# EAGLE design Proto_shield_REV3 (EAGLE 6.6.0)
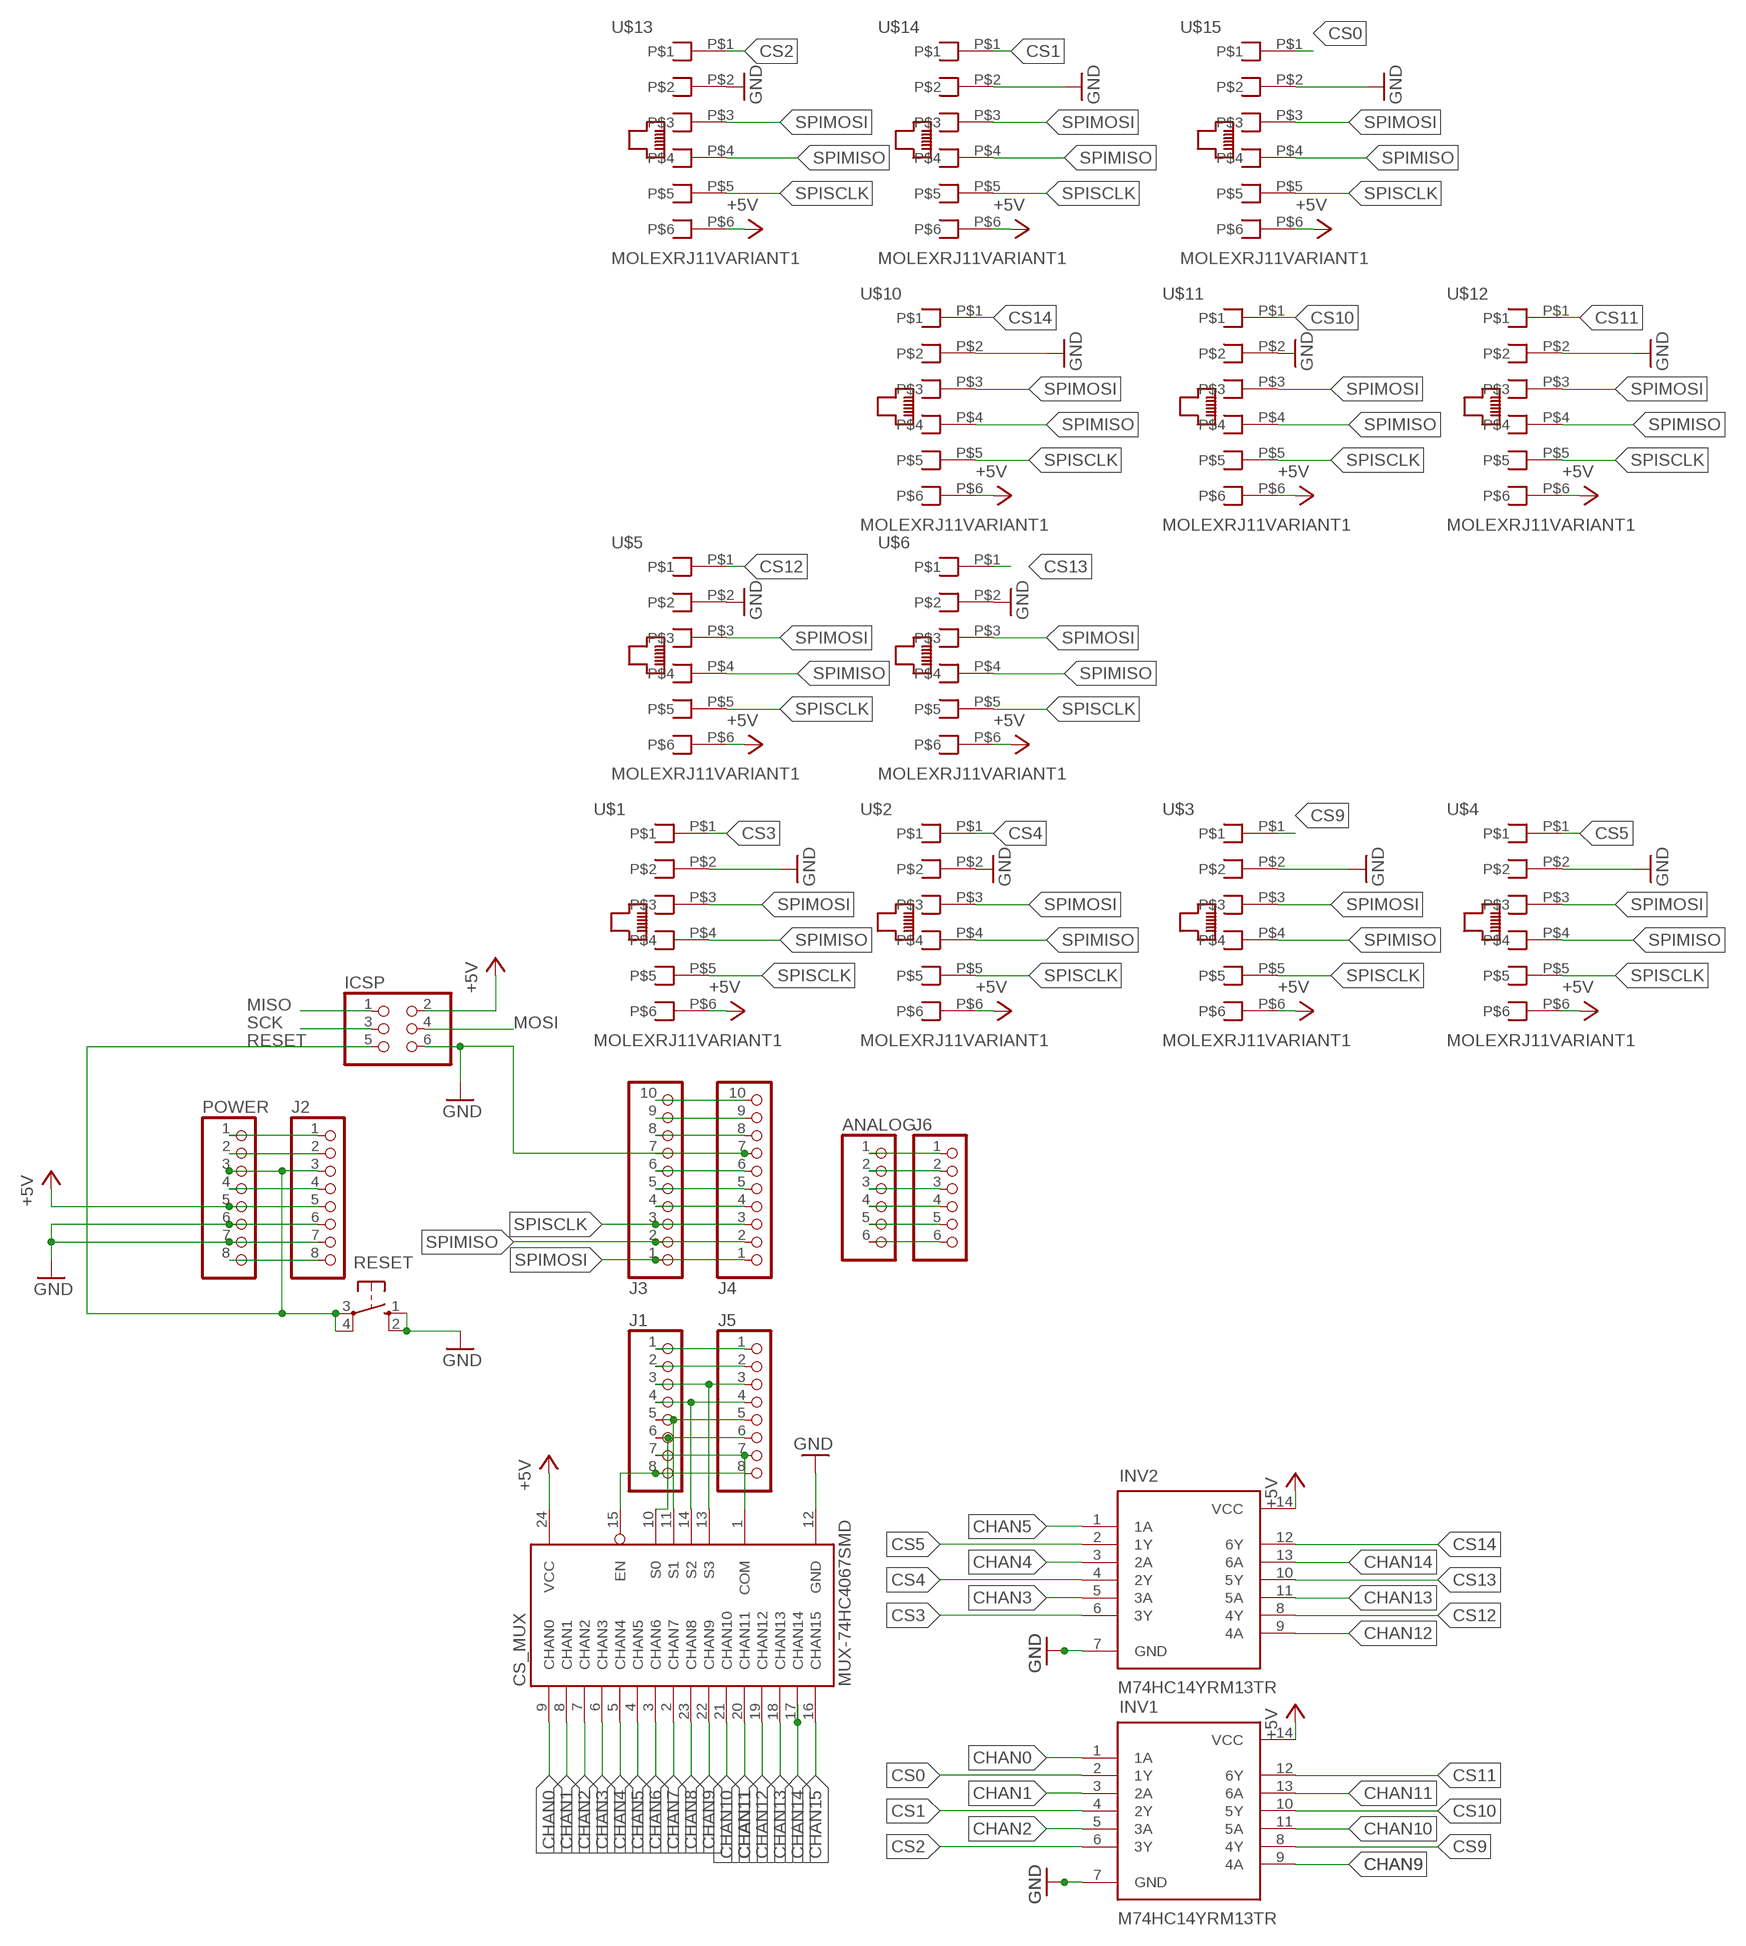
[diagram p0: schematic, sheet 1]

## Parts
ANALOG  PINHD-1X6  [1X06]
CS_MUX  MUX-74HC4067SMD  [SSOP24]
ICSP  PINHD-2X3  [2X03]
INV1  M74HC14YRM13TR  [SO14]
INV2  M74HC14YRM13TR  [SO14]
J1  PINHD-1X8TH  [1X08-TH]
J2  PINHD-1X8TH  [1X08-TH]
J3  PINHD-1X10TH  [1X10-TH]
J4  PINHD-1X10TH  [1X10-TH]
J5  PINHD-1X8TH  [1X08-TH]
J6  PINHD-1X6  [1X06]
POWER  PINHD-1X8TH  [1X08-TH]
RESET  10-XX  [B3F-10XX]
U$1  MOLEXRJ11VARIANT1  [RJ11MOLEX]
U$2  MOLEXRJ11VARIANT1  [RJ11MOLEX]
U$3  MOLEXRJ11VARIANT1  [RJ11MOLEX]
U$4  MOLEXRJ11VARIANT1  [RJ11MOLEX]
U$5  MOLEXRJ11VARIANT1  [RJ11MOLEX]
U$6  MOLEXRJ11VARIANT1  [RJ11MOLEX]
U$10  MOLEXRJ11VARIANT1  [RJ11MOLEX]
U$11  MOLEXRJ11VARIANT1  [RJ11MOLEX]
U$12  MOLEXRJ11VARIANT1  [RJ11MOLEX]
U$13  MOLEXRJ11VARIANT1  [RJ11MOLEX]
U$14  MOLEXRJ11VARIANT1  [RJ11MOLEX]
U$15  MOLEXRJ11VARIANT1  [RJ11MOLEX]

## Nets
+5V [+5V]: CS_MUX.24(VCC) ICSP.2 INV1.14(VCC) INV2.14(VCC) J2.5 POWER.5 U$1.P$6 U$2.P$6 U$3.P$6 U$4.P$6 U$5.P$6 U$6.P$6 U$10.P$6 U$11.P$6 U$12.P$6 U$13.P$6 U$14.P$6 U$15.P$6
+9V: J2.8 POWER.8
CHAN0: CS_MUX.9(CHAN0) INV1.1(1A)
CHAN1: CS_MUX.8(CHAN1) INV1.3(2A)
CHAN2: CS_MUX.7(CHAN2) INV1.5(3A)
CHAN3: CS_MUX.6(CHAN3) INV2.5(3A)
CHAN4: CS_MUX.5(CHAN4) INV2.3(2A)
CHAN5: CS_MUX.4(CHAN5) INV2.1(1A)
CHAN6: CS_MUX.3(CHAN6)
CHAN7: CS_MUX.2(CHAN7)
CHAN8: CS_MUX.23(CHAN8)
CHAN9: CS_MUX.22(CHAN9) INV1.9(4A)
CHAN10: CS_MUX.21(CHAN10) INV1.11(5A)
CHAN11: CS_MUX.20(CHAN11) INV1.13(6A)
CHAN12: CS_MUX.19(CHAN12) INV2.9(4A)
CHAN13: CS_MUX.18(CHAN13) INV2.11(5A)
CHAN14: CS_MUX.17(CHAN14) INV2.13(6A)
CHAN15: CS_MUX.16(CHAN15)
CS0: INV1.2(1Y) U$15.P$1
CS1: INV1.4(2Y) U$14.P$1
CS2: INV1.6(3Y) U$13.P$1
CS3: INV2.6(3Y) U$1.P$1
CS4: INV2.4(2Y) U$2.P$1
CS5: INV2.2(1Y) U$4.P$1
CS9: INV1.8(4Y) U$3.P$1
CS10: INV1.10(5Y) U$11.P$1
CS11: INV1.12(6Y) U$12.P$1
CS12: INV2.8(4Y) U$5.P$1
CS13: INV2.10(5Y) U$6.P$1
CS14: INV2.12(6Y) U$10.P$1
GND [GND]: CS_MUX.12(GND) ICSP.6 INV1.7(GND) INV2.7(GND) J2.7 J3.7 J4.7 POWER.7 RESET.1(S) RESET.2(S1) U$1.P$2 U$2.P$2 U$3.P$2 U$4.P$2 U$5.P$2 U$6.P$2 U$10.P$2 U$11.P$2 U$12.P$2 U$13.P$2 U$14.P$2 U$15.P$2
MISO: ICSP.1
MOSI: ICSP.4
N$1: J3.6 J4.6
N$3: J3.4 J4.4
N$4: J3.5 J4.5
N$8: J1.1 J5.1
N$9: J1.2 J5.2
N$10: CS_MUX.13(S3) J1.3 J5.3
N$11: CS_MUX.14(S2) J1.4 J5.4
N$12: CS_MUX.11(S1) J1.5 J5.5
N$13: CS_MUX.10(S0) J1.6 J5.6
N$14: CS_MUX.1(COM) J1.7 J5.7
N$15: CS_MUX.15(EN) J1.8 J5.8
N$18: ANALOG.1 J6.1
N$19: ANALOG.2 J6.2
N$20: ANALOG.3 J6.3
N$21: ANALOG.4 J6.4
N$22: ANALOG.5 J6.5
N$23: ANALOG.6 J6.6
N$25: J2.6 POWER.6
N$31: J2.2 POWER.2
N$32: J2.1 POWER.1
N$141: J3.9 J4.9
N$142: J3.10 J4.10
N$222: J3.8 J4.8
N$223: J2.4 POWER.4
RESET: ICSP.5 J2.3 POWER.3 RESET.3(P) RESET.4(P1)
SCK: ICSP.3
SPIMISO: J3.2 J4.2 U$1.P$4 U$2.P$4 U$3.P$4 U$4.P$4 U$5.P$4 U$6.P$4 U$10.P$4 U$11.P$4 U$12.P$4 U$13.P$4 U$14.P$4 U$15.P$4
SPIMOSI: J3.1 J4.1 U$1.P$3 U$2.P$3 U$3.P$3 U$4.P$3 U$5.P$3 U$6.P$3 U$10.P$3 U$11.P$3 U$12.P$3 U$13.P$3 U$14.P$3 U$15.P$3
SPISCLK: J3.3 J4.3 U$1.P$5 U$2.P$5 U$3.P$5 U$4.P$5 U$5.P$5 U$6.P$5 U$10.P$5 U$11.P$5 U$12.P$5 U$13.P$5 U$14.P$5 U$15.P$5

## Library data of the parts
ANALOG J6 = pinhead:PINHD-1X6: PIN HEADER
CS_MUX = Analog-Digital-Mux-Breakout:MUX-74HC4067
ICSP = SmartPrj:PINHD-2X3: PIN HEADER
INV1 INV2 = evan1:M74HC14YRM13TR: INV inverter inversion not gate 6 line
J1 J2 J5 POWER = SmartPrj:PINHD-1X8: PIN HEADER
J3 J4 = SmartPrj:PINHD-1X10: PIN HEADER
RESET = switch-omron:10-XX: OMRON SWITCH
U$1-U$6 U$10-U$15 = evan1:MOLEXRJ11: MOLEX RJ11 TELEPHONE CONNECTOR 6 WIRE SMD

## Net classes
1 +5V: width 0.457 mm
2 GND: width 0.457 mm

## Board
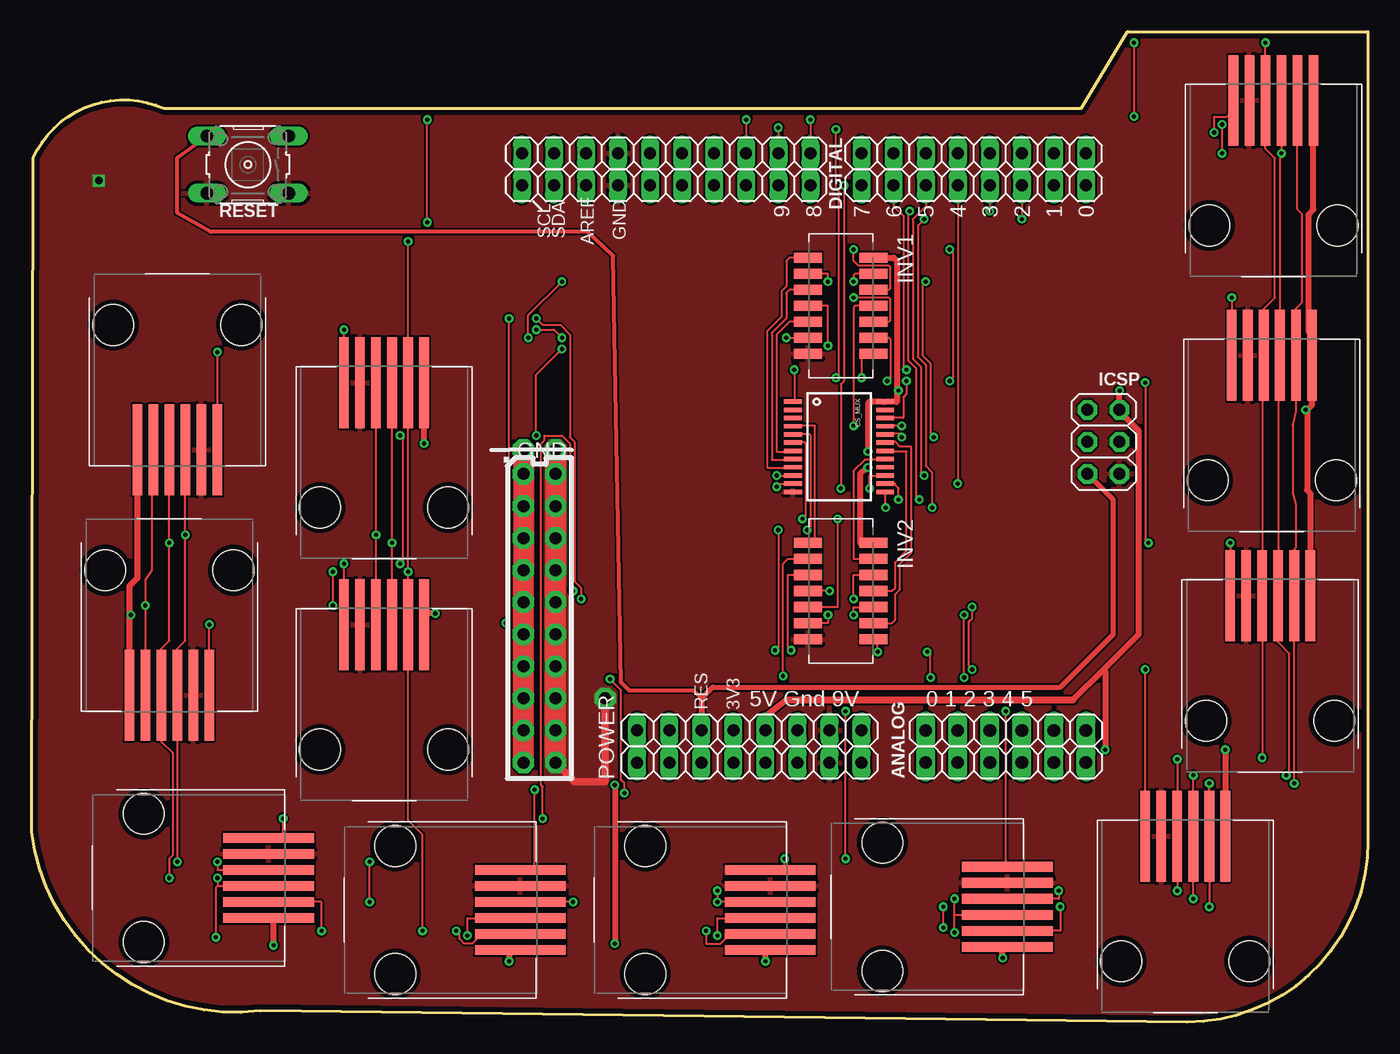
[diagram p1: board, top side]
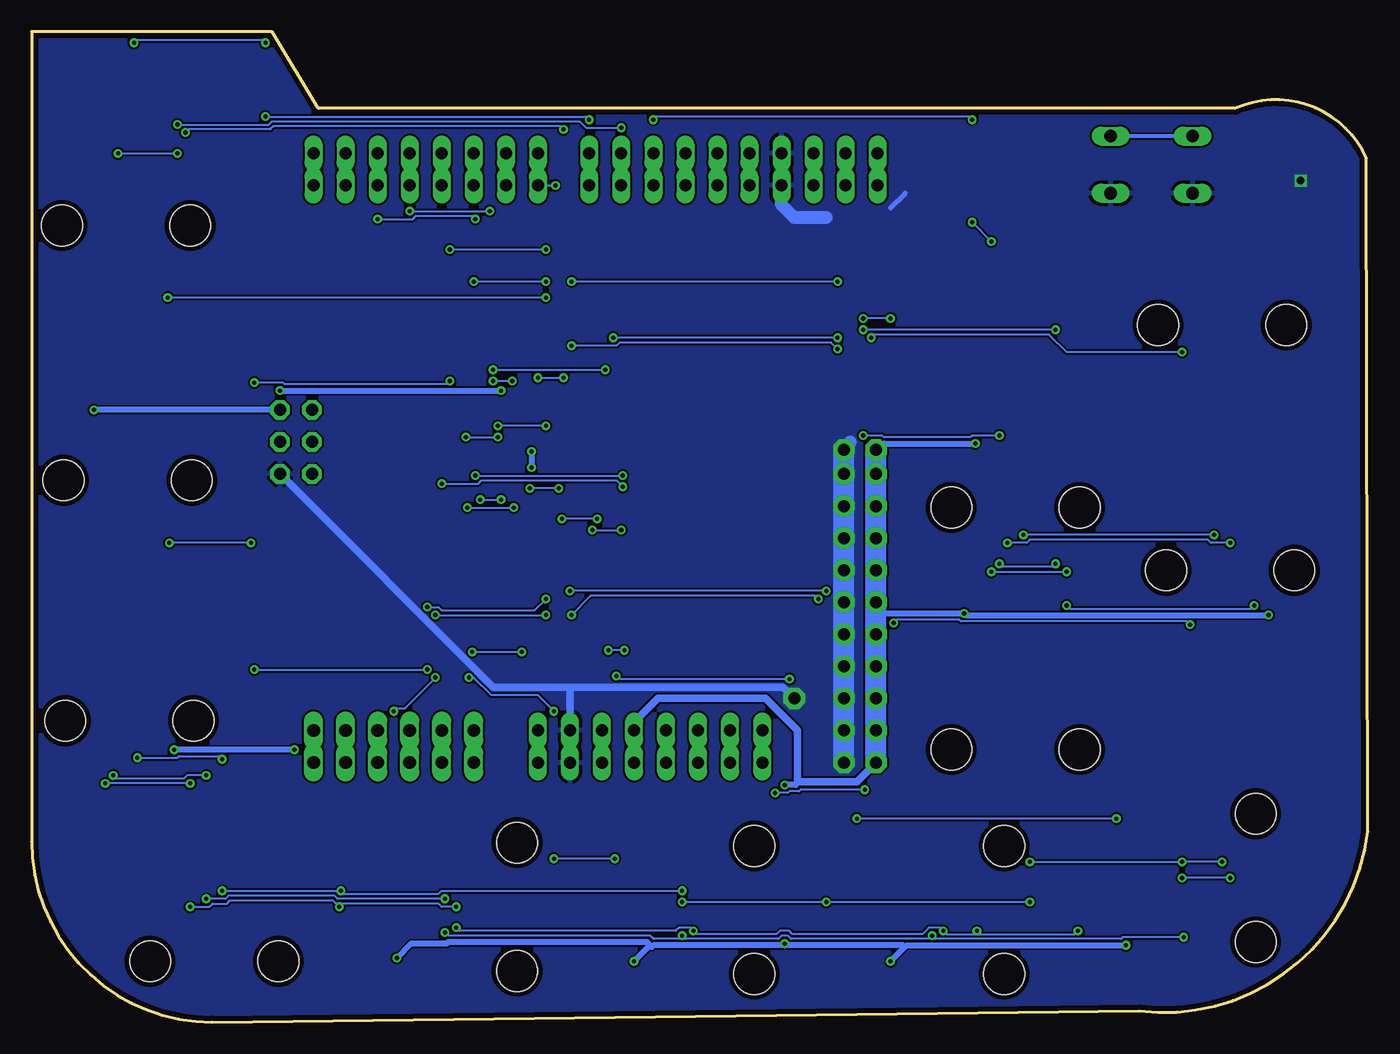
[diagram p2: board, bottom side, seen from below]

Size 105.92 x 78.49 mm. Coordinates in mm from the lower left corner, seen from the top.
Outline: 83.19,72.39 86.87,78.49 105.92,78.49 105.92,14.34 arc-90 91.58,0 18.14,0.89 arc-90 0,15.1 0.13,68.47 arc-90 10.52,72.39 83.19,72.39
Copper layers (1*16): Top 0.0356mm / dielectric 1.5011mm / Bottom 0.0356mm
Design rules "OSHParkPCBOrder": minimum track width 6mil, minimum drill 13mil, track to track 6mil, track to pad 6mil, pad to pad 6mil, via to via 6mil, smd to smd 6mil, copper to edge 15mil, drill to drill 6mil, minimum pad ring 7mil, minimum via ring 7mil, stop-mask expansion 3mil, vias tented up to drill 0mil, thermal gap 10mil

### Footprints (pad centres in the part's own frame; a part is rotated, then mirrored left to right if it is on the bottom)
1X06 = drill 1.016 long: 1 -6.35,0; 2 -3.81,0; 3 -1.27,0; 4 1.27,0; 5 3.81,0; 6 6.35,0
SSOP24 = smd 0.348 x 1.397: 1 -3.575,-3.656; 2 -2.925,-3.656; 3 -2.275,-3.656; 4 -1.625,-3.656; 5 -0.975,-3.656; 6 -0.325,-3.656; 7 0.325,-3.656; 8 0.975,-3.656; 9 1.625,-3.656; 10 2.275,-3.656; 11 2.925,-3.656; 12 3.575,-3.656; 13 3.575,3.656; 14 2.925,3.656; 15 2.275,3.656; 16 1.625,3.656; 17 0.975,3.656; 18 0.325,3.656; 19 -0.325,3.656; 20 -0.975,3.656; 21 -1.625,3.656; 22 -2.275,3.656; 23 -2.925,3.656; 24 -3.575,3.656
2X03 = drill 0.95 pad 1.55 octagon: 1 -2.54,-1.27; 2 -2.54,1.27; 3 0,-1.27; 4 0,1.27; 5 2.54,-1.27; 6 2.54,1.27
SO14 = smd 0.8 x 2.2: 1 -3.81,-2.6; 2 -2.54,-2.6; 3 -1.27,-2.6; 4 0,-2.6; 5 1.27,-2.6; 6 2.54,-2.6; 7 3.81,-2.6; 8 3.81,2.6; 9 2.54,2.6; 10 1.27,2.6; 11 0,2.6; 12 -1.27,2.6; 13 -2.54,2.6; 14 -3.81,2.6
1X08-TH = drill 0.95 pad 1.422 long: 1 -8.89,0; 2 -6.35,0; 3 -3.81,0; 4 -1.27,0; 5 1.27,0; 6 3.81,0; 7 6.35,0; 8 8.89,0
1X10-TH = drill 0.95 pad 1.422 long: 1 -11.43,0; 2 -8.89,0; 3 -6.35,0; 4 -3.81,0; 5 -1.27,0; 6 1.27,0; 7 3.81,0; 8 6.35,0; 9 8.89,0; 10 11.43,0
B3F-10XX = drill 1.016 long: 1 -3.251,2.261; 2 3.251,2.261; 3 -3.251,-2.261; 4 3.251,-2.261
RJ11MOLEX = smd 0.76 x 7.2: P$1 -3.175,0; P$2 -1.905,0; P$3 -0.635,0; P$4 0.635,0; P$5 1.905,0; P$6 3.175,0 | hole 3.25: -5.08,-9.9; 5.08,-9.9

### Placement (x,y rotation side)
ANALOG  77.22,20.57 0 top
CS_MUX  64.01,45.59 270 top
ICSP  84.96,45.97 270 top
INV1  64.13,56.77 270 top
INV2  64.13,34.16 270 top
J1  74.68,68.83 180 top
J2  56.9,20.57 0 top
J3  50.29,68.83 180 top
J4  50.29,66.29 180 top
J5  74.68,66.29 180 top
J6  77.22,23.11 0 top
POWER  56.9,23.11 0 top
RESET  17.14,67.94 180 top
U$1  10.92,25.91 180 top
U$2  18.8,11.43 270 top
U$3  98.42,73.03 0 top
U$4  38.73,8.89 270 top
U$5  58.55,8.89 270 top
U$6  77.34,9.14 270 top
U$10  91.44,14.73 0 top
U$11  98.3,52.83 0 top
U$12  98.17,33.78 0 top
U$13  27.94,50.67 0 top
U$14  27.94,31.5 0 top
U$15  11.56,45.34 180 top

### Tracks (layer width: path | path; a pad name or v marks a point on that pad's centre or on a via)
+5V  (via drill 0.33, 0.95 pad 1.7)
  Top 0.254: 60.71,25.65 60.71,25.53
  Top 0.406: 59.94,25.53 59.82,25.53
  Top 0.457: 82.55,25.53 84.96,27.94 | 84.96,27.94 87.76,30.73 87.76,46.86 86.23,48.39 | POWER.5 58.17,24.26 59.82,25.53 | U$2.P$6 19.18,8.26 v19.18,6.1 | v37.85,4.83 37.85,5.59 37.97,5.71 U$4.P$6 | U$5.P$6 58.17,5.71 v58.17,4.83 | U$6.P$6 76.96,5.97 v76.96,5.08 | U$12.P$6 101.35,41.91 101.09,42.16 101.09,48.51 | 101.09,48.51 101.47,48.9 U$11.P$6 101.47,54.48 101.22,54.74 101.22,64.01 101.6,64.39 U$3.P$6 | 7.75,32.26 7.75,34.54 8.38,35.18 U$15.P$6 | 7.75,32.26 U$1.P$6 | 68.58,50.04 68.58,60.33 68.33,60.58 INV1.14 | 68.58,50.04 68.58,49.15 67.69,49.15 CS_MUX.24 67.44,49.15 66.42,49.15 66.29,49.02 v66.29,45.21 | INV2.14 65.66,37.97 65.66,43.43 66.17,43.94 v66.29,43.94 | U$14.P$6 31.12,32.26 31.24,32.39 v32,32.39 | v31.12,45.85 U$13.P$6 | v94.61,21.59 U$10.P$6 | v85.09,21.59 85.09,27.81 84.96,27.94 | ICSP.2 v86.23,50.04 | v68.71,50.04 68.58,50.04 | v7.87,32.26 7.75,32.26 | v100.97,48.51 101.09,48.51 | v46.23,18.8 v46.23,6.22
  Top 0.559: 59.94,25.53 60.71,25.53 82.55,25.53 | 86.23,48.39 ICSP.2
  Top 1.676: v38.99,20.57 v38.99,23.11 v38.99,25.65 v38.99,28.19 v38.99,30.73 v38.99,33.27 v38.99,35.81 v38.99,38.35 v38.99,40.89 v38.99,43.43 v38.99,45.34
  Bottom 0.457: v19.18,6.1 36.58,6.1 36.7,5.97 | v37.85,4.83 36.7,5.97 | 57.02,5.97 v58.17,4.83 | 57.02,5.97 56.77,5.97 56.64,6.1 46.23,6.1 | 46.23,6.1 36.83,6.1 36.7,5.97 | v76.96,5.08 75.82,6.22 73.03,6.22 72.9,6.35 57.15,6.35 56.9,6.1 57.02,5.97 | v66.29,45.21 v66.29,43.94 | 38.99,32.39 v32,32.39 31.88,32.26 v7.87,32.26 | v31.12,45.85 38.35,45.85 v38.99,45.34 | v85.09,21.59 v94.61,21.59 | v86.23,50.04 v68.71,50.04 | ICSP.2 v100.97,48.51 | v46.23,18.8 45.34,18.8 45.21,19.05 | v46.23,6.22 46.23,6.1
  Bottom 0.61: v38.99,20.57 40.51,19.05 45.21,19.05 45.21,23.11 47.75,25.65 56.26,25.65 58.17,23.75 POWER.5 J2.5
  Bottom 1.676: v38.99,20.57 38.99,32.39 v38.99,45.34
+9V
  Bottom 0.61: J2.8 POWER.8
CHAN0
  Top 0.152: INV1.1 60.07,60.58 59.82,60.33 59.82,58.29 59.44,57.91 59.44,55.88 58.29,54.74 58.29,43.94 60.33,43.94 CS_MUX.9
CHAN1
  Top 0.152: INV1.3 60.07,58.04 59.82,57.79 59.82,55.75 58.67,54.61 58.67,44.58 60.33,44.58 CS_MUX.8
CHAN2
  Top 0.152: INV1.5 60.07,55.5 59.05,54.48 59.05,45.21 60.33,45.21 CS_MUX.7
CHAN3  (via drill 0.33)
  Top 0.152: INV2.5 63.88,32.89 v63.88,39.88 | v61.09,39.88 61.34,40.13 61.34,45.85 61.21,45.97 60.45,45.97 CS_MUX.6
  Bottom 0.152: v61.09,39.88 v63.88,39.88
CHAN4  (via drill 0.33)
  Top 0.152: INV2.3 59.94,35.43 59.94,29.59 60.07,29.46 v60.2,29.46 | v58.93,29.46 59.18,29.72 v59.18,38.99 | v61.47,38.99 61.72,39.24 61.72,46.48 61.59,46.61 60.45,46.61 CS_MUX.5
  Bottom 0.152: v58.93,29.46 v60.2,29.46 | v61.47,38.99 v59.18,38.99
CHAN5
  Top 0.152: INV2.1 62.1,37.97 62.1,47.24 60.45,47.24 CS_MUX.4
CHAN9  (via drill 0.33)
  Top 0.152: v69.34,50.8 69.34,49.78 69.09,49.53 69.09,47.88 67.69,47.88 CS_MUX.22 | v67.82,50.8 68.07,51.05 68.07,54.1 67.95,54.23 INV1.9
  Bottom 0.152: v67.82,50.8 v69.34,50.8
CHAN10  (via drill 0.33)
  Top 0.152: v68.96,47.24 67.69,47.24 CS_MUX.21 | v65.15,47.24 65.15,56.64 65.28,56.77 INV1.11
  Bottom 0.152: v65.15,47.24 v68.96,47.24
CHAN11  (via drill 0.33)
  Top 0.152: v68.96,46.35 68.96,46.61 67.69,46.61 CS_MUX.20 | v71.5,46.35 71.25,46.61 71.25,52.2 70.61,52.83 70.61,58.42 v70.87,58.67 | v65.15,58.67 65.15,59.18 65.28,59.31 INV1.13
  Bottom 0.152: v71.5,46.35 v68.96,46.35 | v65.15,58.67 v70.87,58.67
CHAN12
  Top 0.152: INV2.9 68.2,31.62 68.45,31.88 68.45,33.91 68.83,34.29 68.83,36.32 69.72,37.21 69.72,45.59 68.83,45.59 68.45,45.97 67.69,45.97 CS_MUX.19
CHAN13
  Top 0.152: INV2.11 68.2,34.16 68.45,34.42 68.45,36.45 69.34,37.34 69.34,45.21 67.69,45.21 CS_MUX.18
CHAN14
  Top 0.152: INV2.13 65.15,36.7 65.15,43.69 66.04,44.58 67.56,44.58 CS_MUX.17
CS0  (via drill 0.33)
  Top 0.152: INV1.2 63.12,59.31 v63.12,58.67 | v42.04,58.67 39.37,56.01 v39.37,54.23 | U$15.P$1 v14.73,53.09
  Bottom 0.152: v42.04,58.67 v63.12,58.67 | v39.37,54.23 39.12,54.48 25.27,54.48 23.88,53.09 v14.73,53.09
CS1  (via drill 0.33)
  Top 0.152: INV1.4 63.12,56.77 v63.12,53.59 | v42.04,53.34 40.01,51.31 v40.01,46.48 | v29.21,46.48 29.46,46.23 29.46,36.58 v29.21,36.32 | U$14.P$1 v24.77,36.32
  Bottom 0.152: v63.12,53.59 59.56,53.59 59.31,53.85 42.55,53.85 v42.04,53.34 | v40.01,46.48 38.48,46.48 38.35,46.35 31.5,46.35 31.37,46.48 v29.21,46.48 | v29.21,36.32 28.96,36.07 25.02,36.07 v24.77,36.32
CS2  (via drill 0.33)
  Top 0.152: v59.82,54.23 INV1.6 | v42.04,54.23 41.4,54.86 v40.01,54.86 | U$13.P$1 v24.77,54.86
  Bottom 0.152: v42.04,54.23 v59.82,54.23 | v24.77,54.86 v40.01,54.86
CS3  (via drill 0.33)
  Top 0.152: INV2.6 63.12,31.62 v63.12,32.26 | v43.56,33.53 43.56,34.42 43.05,34.92 43.05,45.97 42.67,46.35 42.67,54.48 41.91,55.24 40.51,55.24 v40.01,55.75 | v37.85,55.75 37.85,31.88 v37.59,31.62 | U$1.P$1 v14.1,31.5
  Bottom 0.152: v63.12,32.26 61.59,33.78 43.81,33.78 v43.56,33.53 | v37.85,55.75 v40.01,55.75 | v37.59,31.62 37.34,31.88 32.38,31.88 32.26,31.75 14.35,31.75 v14.1,31.5
CS4  (via drill 0.33)
  Top 0.152: v63.25,34.16 INV2.4 | v42.93,34.16 42.67,34.42 42.67,45.85 42.04,46.48 40.64,46.48 40.64,46.1 40.39,45.85 40.39,18.8 40.51,18.67 v40.51,16.13 | v19.94,16.13 19.94,14.73 19.81,14.61 U$2.P$1
  Bottom 0.152: v42.93,34.16 v63.25,34.16 | v19.94,16.13 v40.51,16.13
CS5  (via drill 0.33)
  Top 0.152: INV2.2 59.94,36.7 59.56,36.32 v59.56,27.43 | v45.85,27.18 46.74,26.29 46.74,19.18 46.99,18.92 v46.99,18.16 | v39.88,18.41 39.88,12.19 39.75,12.07 U$4.P$1
  Bottom 0.152: v59.56,27.43 59.31,27.18 v45.85,27.18 | v46.99,18.16 45.97,18.16 45.85,18.29 45.09,18.29 44.96,18.41 v39.88,18.41
CS9  (via drill 0.33)
  Top 0.152: U$3.P$1 95.25,72.26 94.74,71.75 93.73,71.75 v93.73,70.49 | v63.75,70.74 63.75,66.04 64.01,65.79 64.01,51.31 v63.75,51.05 | v65.79,51.05 65.79,52.83 65.91,52.96 INV1.8
  Bottom 0.152: v93.73,70.49 93.47,70.74 87,70.74 86.74,70.99 64.01,70.99 v63.75,70.74 | v65.79,51.05 v63.75,51.05
CS10  (via drill 0.33)
  Top 0.152: v95.12,57.4 U$11.P$1 | v65.15,57.4 67.95,57.4 68.07,57.28 68.07,55.63 67.95,55.5 INV1.10
  Bottom 0.152: v65.15,57.4 v95.12,57.4
CS11  (via drill 0.33)
  Top 0.152: v95,37.97 U$12.P$1 | v88.52,37.97 88.27,38.23 v88.27,50.67 | v72.77,50.8 73.03,51.05 73.03,60.96 v72.77,61.21 | v65.15,61.21 65.15,60.33 65.53,59.94 67.95,59.94 68.07,59.82 68.07,58.17 67.95,58.04 INV1.12
  Bottom 0.152: v88.52,37.97 v95,37.97 | v88.27,50.67 85.98,50.67 85.85,50.55 73.03,50.55 v72.77,50.8 | v65.15,61.21 v72.77,61.21
CS12  (via drill 0.33)
  Top 0.152: INV2.8 67.06,30.35 v67.06,29.34 | v70.99,29.34 71.25,29.08 v71.25,27.3 | v64.52,12.95 v64.52,24.64 | v59.69,12.95 59.69,12.19 59.56,12.07 U$5.P$1
  Bottom 0.152: v70.99,29.34 v67.06,29.34 | v71.25,27.3 70.87,27.3 69.47,25.91 65.79,25.91 v64.52,24.64 | v59.69,12.95 v64.52,12.95
CS13  (via drill 0.33)
  Top 0.152: INV2.10 65.15,32.89 v65.15,32.26 | v73.91,27.3 v73.91,32.26 | v77.22,24.64 77.22,12.32 U$6.P$1
  Bottom 0.152: v73.91,32.26 v65.15,32.26 | v73.91,27.3 76.33,24.89 76.96,24.89 v77.22,24.64
CS14  (via drill 0.33)
  Top 0.152: INV2.12 65.15,35.43 v65.15,33.53 | v74.55,32.89 74.55,32 74.3,31.75 74.3,28.19 v74.55,27.94 | U$10.P$1 v88.27,27.94
  Bottom 0.152: v65.15,33.53 66.04,32.64 73.41,32.64 73.66,32.89 v74.55,32.89 | v88.27,27.94 v74.55,27.94
GND  (via drill 0.6, 0.95 pad 1.7)
  Top 0.61: v41.53,20.57 43.05,19.05 45.47,19.05 v45.47,25.65
  Top 1.676: v41.53,20.57 v41.53,23.11 v41.53,25.65 v41.53,28.19 v41.53,30.73 v41.53,33.27 v41.53,35.81 v41.53,38.35 v41.53,40.89 v41.53,43.43 v41.53,45.34
  Bottom 0.406: 37.85,64.52 36.68,65.68
  Bottom 0.61: v45.47,25.65 46.36,26.54 63.25,26.54 | J4.7 J3.7 | J2.7 POWER.7 63.25,26.54 | ICSP.6 69.34,26.54 63.25,26.54
  Bottom 1.016: J4.7 46.48,64.77 45.47,63.75 42.93,63.75 | 41.02,45.97 41.4,45.34 v41.53,45.34
  Bottom 1.676: v41.53,20.57 v41.53,45.34
  other vias: 5.33,66.67
  pour Bottom: -1.02,60.33 -1.02,78.1 80.9,77.47 80.9,84.46 109.47,84.46 109.47,-5.08 -3.56,-5.08
  pour Top: -2.29,73.66 83.44,76.2 83.44,82.55 115.19,82.55 115.19,57.15 112.65,57.15 112.65,-9.53 0.89,-9.53 0.89,2.54 -2.29,2.54
N$1
  Bottom 0.61: J4.6 J3.6
N$3
  Bottom 0.61: J4.4 J3.4
N$4
  Bottom 0.61: J4.5 J3.5
N$8
  Bottom 0.61: J5.1 J1.1
N$9
  Bottom 0.61: J5.2 J1.2
N$10  (via drill 0.33)
  Top 0.152: v67.69,40.77 67.69,41.91 CS_MUX.13 | v71.37,40.77 71.37,43.56 70.87,44.07 70.87,52.07 70.23,52.7 70.23,63.12 v70.74,63.63 | J5.3 v78.49,63.63
  Bottom 0.152: v71.37,40.77 v67.69,40.77 | v70.74,63.63 70.99,63.88 75.44,63.88 75.69,63.63 v78.49,63.63
  Bottom 0.61: J5.3 J1.3
N$11  (via drill 0.33)
  Top 0.152: v68.71,41.4 68.71,42.29 68.45,42.55 68.45,42.67 67.69,42.67 CS_MUX.14 | v70.36,41.4 70.1,41.66 70.1,51.82 69.47,52.45 69.47,64.13 v69.6,64.26 | J5.4 v75.95,64.26
  Bottom 0.152: v70.36,41.4 v68.71,41.4 | v75.95,64.26 v69.6,64.26
  Bottom 0.61: J5.4 J1.4
N$12  (via drill 0.33)
  Top 0.152: v59.05,42.42 59.05,42.67 60.33,42.67 CS_MUX.11 | J5.5 v73.41,42.67
  Bottom 0.152: v59.05,42.42 59.56,42.93 70.23,42.93 70.48,42.67 v73.41,42.67
  Bottom 0.61: J5.5 J1.5
N$13  (via drill 0.33)
  Top 0.152: v59.05,43.31 60.33,43.31 CS_MUX.10 | v70.74,43.31 70.48,43.56 70.48,51.94 69.85,52.58 69.85,63.63 70.87,64.64 J5.6
  Bottom 0.152: v70.74,43.31 v59.05,43.31
  Bottom 0.61: J5.6 J1.6
N$14  (via drill 0.33)
  Top 0.152: v60.45,51.69 60.45,49.28 CS_MUX.1 | v69.34,51.69 69.09,51.94 69.09,63.88 68.33,64.64 J5.7
  Bottom 0.152: v69.34,51.69 v60.45,51.69
  Bottom 0.61: J5.7 J1.7
N$15  (via drill 0.33)
  Top 0.152: v66.42,42.29 66.42,43.31 67.56,43.31 CS_MUX.15 | v64.13,42.29 64.13,50.55 64.39,50.8 v64.39,66.29
  Bottom 0.152: v64.13,42.29 v66.42,42.29 | J5.8 v64.39,66.29
  Bottom 0.61: J5.8 J1.8
N$18
  Bottom 0.61: ANALOG.1 J6.1
N$19
  Bottom 0.61: ANALOG.2 J6.2
N$20
  Bottom 0.61: ANALOG.3 J6.3
N$21
  Bottom 0.61: ANALOG.4 J6.4
N$22
  Bottom 0.61: ANALOG.5 J6.5
N$23
  Bottom 0.61: ANALOG.6 J6.6
N$25
  Bottom 0.61: J2.6 POWER.6
N$31
  Bottom 0.61: J2.2 POWER.2
N$32
  Bottom 0.61: J2.1 POWER.1
N$141
  Bottom 0.61: J4.9 J3.9
N$142
  Bottom 0.61: J4.10 J3.10
N$222
  Bottom 0.61: J4.8 J3.8
N$223
  Bottom 0.61: J2.4 POWER.4
RESET
  Top 0.305: 53.09,25.65 52.45,26.29 47.37,26.29 46.74,26.92 46.1,60.71 44.07,62.61 14.22,62.61 11.56,64.13 11.56,68.5 RESET.4
  Top 0.406: 53.09,25.65 53.98,26.54 81.53,26.54 85.72,30.73 85.72,41.4 ICSP.5
  Top 0.457: 53.09,25.65 POWER.3
  Bottom 0.305: RESET.4 RESET.3
  Bottom 0.61: POWER.3 J2.3
SPIMISO  (via drill 0.33)
  Top 0.152: v59.18,70.87 J3.2 | v94.36,68.83 v94.36,71.12 | U$3.P$4 v99.06,68.83 98.93,68.71 U$11.P$4 98.93,51.18 98.81,51.05 U$12.P$4 98.81,30.1 99.7,29.21 99.7,19.81 v99.44,19.56 | U$14.P$4 v28.57,37.97 U$13.P$4 | 14.73,10.79 U$2.P$4 | v14.73,11.43 14.73,10.79 | v10.92,11.43 10.92,12.95 11.18,13.21 11.18,21.34 10.29,22.23 U$1.P$4 10.29,29.59 10.92,30.23 v10.92,37.97 U$15.P$4 | U$4.P$4 34.54,8.26 v34.54,6.86 | v14.61,6.73 14.61,10.67 14.73,10.79 | U$5.P$4 54.36,8.26 v54.36,6.86 | 73.15,8.51 U$6.P$4 | v73.15,7.11 73.15,8.51 | v92.08,9.78 U$10.P$4 v92.08,19.56 | 73.15,8.51 v73.15,9.78
  Bottom 0.152: v59.18,70.87 61.98,70.87 62.48,71.37 86.87,71.37 87.12,71.12 v94.36,71.12 | v99.06,68.83 v94.36,68.83 | v10.92,11.43 v14.73,11.43 | 34.29,6.6 v34.54,6.86 | 34.29,6.6 19.56,6.6 19.43,6.73 v14.61,6.73 | 54.1,6.6 v54.36,6.86 | 54.1,6.6 46.74,6.6 46.48,6.86 45.97,6.86 45.72,6.6 34.29,6.6 | v73.15,7.11 72.9,6.86 56.9,6.86 56.64,6.6 54.1,6.6 | v92.08,9.78 90.55,9.78 90.3,10.03 81.92,10.03 81.66,9.78 v73.15,9.78 | v28.57,37.97 27.05,37.97 26.8,38.23 12.7,38.23 12.45,37.97 v10.92,37.97 | v99.44,19.56 99.19,19.3 93.85,19.3 93.6,19.56 v92.08,19.56
  Bottom 0.61: J4.2 J3.2
SPIMOSI  (via drill 0.33)
  Top 0.152: U$14.P$3 v27.3,38.61 U$13.P$3 | U$2.P$3 14.73,12.07 v14.73,12.7 | v11.56,12.7 U$1.P$3 11.56,29.59 12.19,30.23 v12.19,38.61 U$15.P$3 | v61.72,71.5 J3.1 | v87.38,77.6 v87.38,71.75 | v97.79,77.6 U$3.P$3 97.79,69.22 98.55,68.45 98.55,57.4 97.66,56.52 U$11.P$3 97.66,51.18 97.54,51.05 U$12.P$3 v97.54,20.96 | v42.93,9.53 U$4.P$3 | U$5.P$3 v54.36,9.53 v54.36,10.41 | U$6.P$3 81.41,9.78 v81.41,10.41 | v90.81,10.41 U$10.P$3 v90.81,20.83 | v26.8,9.53 v26.8,12.7
  Bottom 0.152: v11.56,12.7 v14.73,12.7 v26.8,12.7 | v12.19,38.61 v27.3,38.61 | v61.72,71.5 61.98,71.75 v87.38,71.75 | v87.38,77.6 87.63,77.85 97.54,77.85 v97.79,77.6 | v54.36,9.53 v42.93,9.53 v26.8,9.53 | v90.81,10.41 81.79,10.41 | 81.79,10.41 v81.41,10.41 | v90.81,20.83 91.06,21.08 94.23,21.08 94.36,20.96 v97.54,20.96 | v54.36,10.41 73.41,10.41 73.66,10.16 81.53,10.16 81.79,10.41
  Bottom 0.61: J4.1 J3.1
SPISCLK  (via drill 0.33)
  Top 0.152: U$1.P$5 v9.02,33.02 9.02,35.05 9.52,35.81 9.52,41.53 9.65,42.93 U$15.P$5 | v56.64,71.5 J3.3 | v31.37,63.37 v31.37,71.5 | v29.85,61.85 U$13.P$5 v29.85,35.69 U$14.P$5 29.85,16 30.99,14.86 v30.99,7.24 | v23.88,35.69 v23.88,33.02 | U$3.P$5 100.33,64.39 100.71,64.01 100.71,57.02 100.2,56.52 U$11.P$5 100.2,48.39 99.95,47.37 99.95,41.91 100.2,41.02 100.2,37.59 100.08,37.47 U$12.P$5 v100.08,18.92 | U$6.P$5 81.53,7.24 v81.53,9.14 | v93.34,9.14 U$10.P$5 v93.34,18.92 | U$2.P$5 22.99,9.53 v22.99,7.24 | v33.66,7.24 33.91,6.99 33.91,6.6 34.29,6.22 34.93,6.22 35.69,6.99 U$4.P$5 | U$5.P$5 54.99,6.99 54.99,6.6 54.61,6.22 53.47,6.22 v53.47,7.24 | v72.26,7.49 v72.26,9.14
  Bottom 0.152: v56.64,71.5 56.39,71.75 31.62,71.75 v31.37,71.5 | v29.85,61.85 v31.37,63.37 | v9.02,33.02 9.27,32.77 23.62,32.77 v23.88,33.02 | v29.85,35.69 v23.88,35.69 | 81.79,9.4 82.04,9.65 90.17,9.65 90.42,9.4 91.57,9.4 91.82,9.14 v93.34,9.14 | 81.79,9.4 v81.53,9.14 | v22.99,7.24 23.24,6.99 30.99,6.99 | 30.99,6.99 33.4,6.99 v33.66,7.24 33.91,7.49 34.8,7.49 35.31,6.99 45.59,6.99 45.85,7.24 46.61,7.24 46.86,6.99 53.21,6.99 v53.47,7.24 53.72,7.49 54.61,7.49 54.86,7.24 72.01,7.24 v72.26,7.49 | 81.79,9.4 73.66,9.4 73.41,9.14 v72.26,9.14 | v93.34,18.92 v100.08,18.92 | 30.99,6.99 v30.99,7.24
  Bottom 0.61: J4.3 J3.3

### Text on the board
tPlace: 9 | 8 | 7 | 6 | 5 | 4 | 3 | 2 | 1 | 0 | . | GND
tNames: DIGITAL | AREF | SCL | SDA | GND | 5V Gnd 9V | 0 1 2 3 4 5 | RES | 3V3
bStop: DIGITAL | SCL | SDA | AREF | GND | 13 | 12 | 11 | 10 | 9 | 8 | 7 | 6 | 5 | 4 | 3 | 2 | 1 | 0 | 1 | 2 | 3 | 4 | 5 | 6 | IOREF | RST | 3.3V | 5V | GND | GND | 0 | 1 | 2 | 3 | 4 | 5 | VIN | ANALOG
Reference: USB | ETH
tDocu: ARCLAB | mBED SHIELD | revA by EJR